# EAGLE schematic DUE_MUSICAL_ROBOTS (EAGLE 6.1)
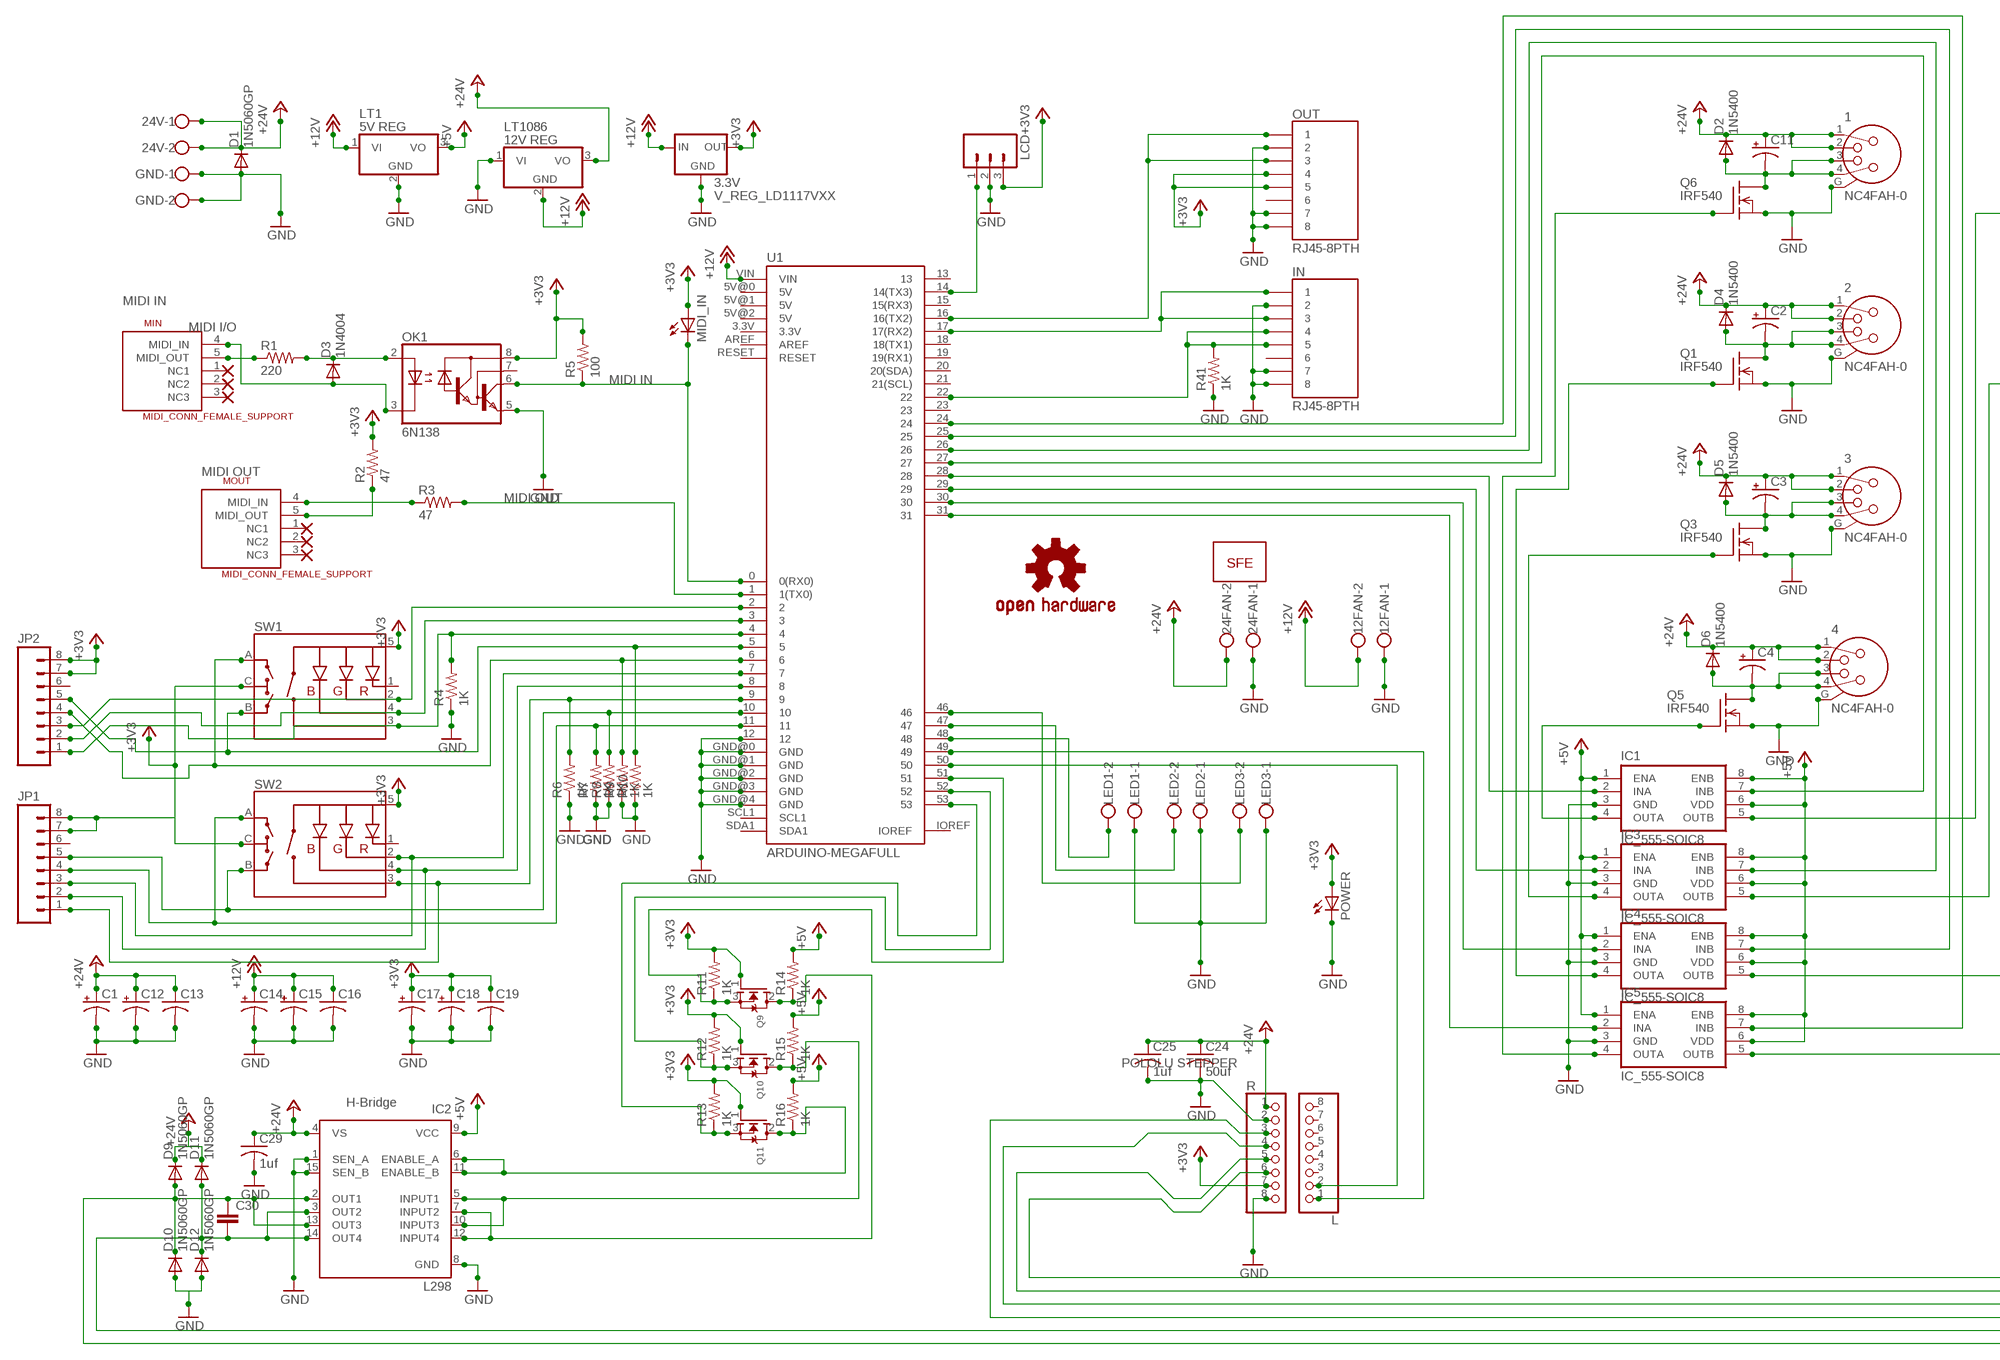
[diagram p0: schematic, sheet 1, part 1 of 2]
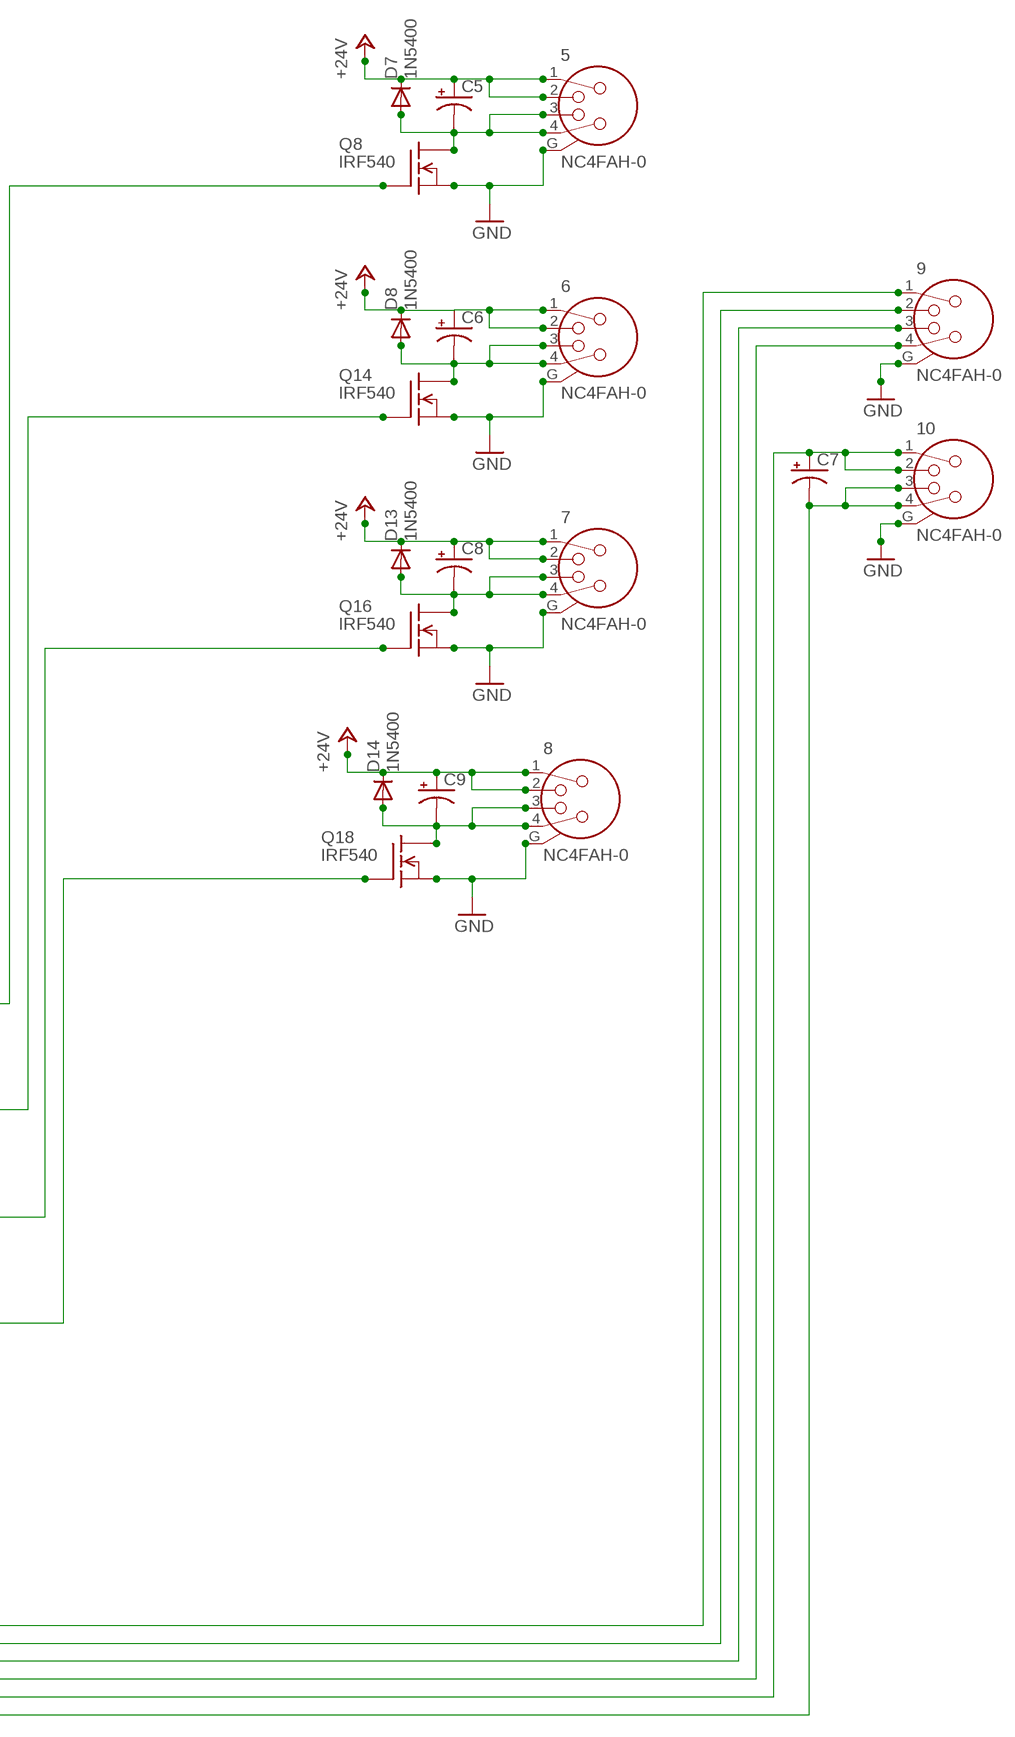
[diagram p1: schematic, sheet 1, part 2 of 2]

## Parts
1  NC4FAH-0  [NC4FAH-0]
2  NC4FAH-0  [NC4FAH-0]
3  NC4FAH-0  [NC4FAH-0]
3.3V  V_REG_LD1117VXX  [78XXL]
4  NC4FAH-0  [NC4FAH-0]
5  NC4FAH-0  [NC4FAH-0]
6  NC4FAH-0  [NC4FAH-0]
7  NC4FAH-0  [NC4FAH-0]
8  NC4FAH-0  [NC4FAH-0]
9  NC4FAH-0  [NC4FAH-0]
10  NC4FAH-0  [NC4FAH-0]
12FAN  W237-102  [W237-102]
24FAN  W237-102  [W237-102]
24V  W237-102  [W237-102]
C1  CPOL-USE2,5-6E  [E2,5-6E]
C2  CPOL-USE2.5-6  [E2,5-6]
C3  CPOL-USE2.5-6  [E2,5-6]
C4  CPOL-USE2.5-6  [E2,5-6]
C5  CPOL-USE2.5-6  [E2,5-6]
C6  CPOL-USE2.5-6  [E2,5-6]
C7  CPOL-USE2.5-6  [E2,5-6]
C8  CPOL-USE2.5-6  [E2,5-6]
C9  CPOL-USE2.5-6  [E2,5-6]
C11  CPOL-USE2.5-6  [E2,5-6]
C12  CPOL-USE2.5-5V  [E2,5-4R]
C13  C-US025-030X050  [C025-030X050]
C14  CPOL-USE2,5-6E  [E2,5-6E]
C15  CPOL-USE2.5-5V  [E2,5-4R]
C16  C-US025-030X050  [C025-030X050]
C17  CPOL-USE2,5-6E  [E2,5-6E]
C18  CPOL-USE2.5-5V  [E2,5-4R]
C19  C-US025-030X050  [C025-030X050]
C24  50uf  C-US050-075X075  [C050-075X075]
C25  1uf  C-US025-050X050  [C025-050X050]
C29  1uf  C-US025-050X050  [C025-050X050]
C30  C-EU025-024X044  [C025-024X044]
D1  1N5060GP  [DO15-12]
D2  1N5400  [DO201-15]
D3  1N4004  [DO41-10@1]
D4  1N5400  [DO201-15]
D5  1N5400  [DO201-15]
D6  1N5400  [DO201-15]
D7  1N5400  [DO201-15]
D8  1N5400  [DO201-15]
D9  1N5060GP  [DO15-12]
D10  1N5060GP  [DO15-12]
D11  1N5060GP  [DO15-12]
D12  1N5060GP  [DO15-12]
D13  1N5400  [DO201-15]
D14  1N5400  [DO201-15]
GND  W237-102  [W237-102]
IC1  IC_555-SOIC8  [SOIC-8]
IC2  L298  [MULTIWATT-15]
IC3  IC_555-SOIC8  [SOIC-8]
IC4  IC_555-SOIC8  [SOIC-8]
IC5  IC_555-SOIC8  [SOIC-8]
IN  RJ45-8PTH  [RJ45-8]
JP1  M083.5MM-8  [SCREWTERMINAL-3.5MM-8]
JP2  M083.5MM-8  [SCREWTERMINAL-3.5MM-8]
JP5  LOGO-SFEM  [SFE-LOGO]
L  PINHD-1X8  [1X08]
LCD  M03LONGPADS  [1X03_LONGPADS]
LED1  W237-102  [W237-102]
LED2  W237-102  [W237-102]
LED3  W237-102  [W237-102]
LT1  5V REG  7805TV  [TO220V]
LT1086  12V REG  7805TV  [TO220V]
MIDI_IN  LED5MM  [LED5MM]
MIN  MIDI_CONN_FEMALE_SUPPORT  [DIN_5_FEMALE_SUPPORT]
MOUT  MIDI_CONN_FEMALE_SUPPORT  [DIN_5_FEMALE_SUPPORT]
OK1  6N138  [DIL08]
OUT  RJ45-8PTH  [RJ45-8]
POWER  LED5MM  [LED5MM]
Q1  IRF540  [TO220]
Q3  IRF540  [TO220]
Q5  IRF540  [TO220]
Q6  IRF540  [TO220]
Q8  IRF540  [TO220]
Q9  MOSFET-NGDS_TO220V  [TO220V]
Q10  MOSFET-NGDS_TO220V  [TO220V]
Q11  MOSFET-NGDS_TO220V  [TO220V]
Q14  IRF540  [TO220]
Q16  IRF540  [TO220]
Q18  IRF540  [TO220]
R  PINHD-1X8  [1X08]
R1  220  R-US_0204/7  [0204/7]
R2  47  R-US_0204/7  [0204/7]
R3  47  R-US_0204/7  [0204/7]
R4  1K  RESISTORAXIAL-0.3  [AXIAL-0.3]
R5  100  R-US_0204/7  [0204/7]
R6  1K  RESISTORAXIAL-0.3  [AXIAL-0.3]
R7  1K  RESISTORAXIAL-0.3  [AXIAL-0.3]
R8  1K  RESISTORAXIAL-0.3  [AXIAL-0.3]
R9  1K  RESISTORAXIAL-0.3  [AXIAL-0.3]
R10  1K  RESISTORAXIAL-0.3  [AXIAL-0.3]
R11  1K  RESISTORAXIAL-0.3  [AXIAL-0.3]
R12  1K  RESISTORAXIAL-0.3  [AXIAL-0.3]
R13  1K  RESISTORAXIAL-0.3  [AXIAL-0.3]
R14  1K  RESISTORAXIAL-0.3  [AXIAL-0.3]
R15  1K  RESISTORAXIAL-0.3  [AXIAL-0.3]
R16  1K  RESISTORAXIAL-0.3  [AXIAL-0.3]
R41  1K  RESISTORAXIAL-0.3  [AXIAL-0.3]
SW1  ENCODER_RGB_CA  [ENCODER_LED_3]
SW2  ENCODER_RGB_CA  [ENCODER_LED_3]
U1  ARDUINO-MEGAFULL  [ARDUINO_MEGA]
U$3  OSHW-LOGOM  [OSHW-LOGO-M]

## Nets
+3V3: 3.3V.GND(OUT) C17.+ C18.+ C19.1 JP1.7 JP1.8 JP2.7 JP2.8 LCD.3 MIDI_IN.A OK1.8(VCC) OUT.4 OUT.5 POWER.A Q9.1(G) Q10.1(G) Q11.1(G) R2.2 R5.2 R11.P$2 R12.P$2 R13.P$2 R.7 SW1.5(+) SW1.C SW2.5(+) SW2.C
+5V: IC1.1(ENA) IC1.6(VDD) IC1.8(ENB) IC2.9(VCC) IC3.1(ENA) IC3.6(VDD) IC3.8(ENB) IC4.1(ENA) IC4.6(VDD) IC4.8(ENB) IC5.1(ENA) IC5.6(VDD) IC5.8(ENB) LT1.3(VO) R14.P$2 R15.P$2 R16.P$2
+12V: 3.3V.OUT(IN) 12FAN.2 C14.+ C15.+ C16.1 LT1.1(VI) LT1086.2(GND) U1.VIN
+24V: 1.1 1.2 2.1 2.2 3.1 3.2 4.1 4.2 5.1 5.2 6.1 6.2 7.1 7.2 8.1 8.2 24FAN.2 24V.1 24V.2 C1.+ C2.+ C3.+ C4.+ C5.+ C6.+ C8.+ C9.+ C11.+ C12.+ C13.1 C24.1 C25.1 C29.1 D1.C D2.C D4.C D5.C D6.C D7.C D8.C D9.C D11.C D13.C D14.C IC2.4(VS) LT1086.3(VO) R.1
DIGITALBUS8: Q10.3(S) R12.P$1 U1.52
DIGITALBUS9: Q11.3(S) R13.P$1 U1.53
DIGITALBUS11: Q9.3(S) R11.P$1 U1.51
GND: 1.G 2.G 3.3V.IN(GND) 3.G 4.G 5.G 6.G 7.G 8.G 9.G 10.G 12FAN.1 24FAN.1 C1.- C12.- C13.2 C14.- C15.- C16.2 C17.- C18.- C19.2 C24.2 C25.2 C29.2 D1.A D10.A D12.A GND.1 GND.2 IC1.3(GND) IC2.1(SEN_A) IC2.8(GND) IC2.15(SEN_B) IC3.3(GND) IC4.3(GND) IC5.3(GND) IN.2 IN.7 IN.8 LCD.2 LED1.1 LED2.1 LED3.1 LT1.2(GND) LT1086.1(VI) OK1.5(GND) OUT.2 OUT.7 OUT.8 POWER.K(C) Q1.3(S) Q3.3(S) Q5.3(S) Q6.3(S) Q8.3(S) Q14.3(S) Q16.3(S) Q18.3(S) R4.P$1 R6.P$1 R7.P$1 R8.P$1 R9.P$1 R10.P$1 R41.P$1 R.2 R.8 U1.12 U1.GND@0(GND) U1.GND@1(GND) U1.GND@2(GND) U1.GND@3(GND) U1.GND@4(GND)
MIDIIN: MIDI_IN.K(C) OK1.6(VO) R5.1 U1.0(0(RX0))
MIDIOUT: R3.2 U1.1(1(TX0))
N$1: MIN.5(MIDI_OUT) R1.1
N$2: D3.C OK1.2(A) R1.2
N$3: 2.3 2.4 C2.- D4.A Q1.2(D)
N$4: IC4.4(OUTA) Q1.1(G)
N$5: D3.A MIN.4(MIDI_IN) OK1.3(C)
N$6: MOUT.5(MIDI_OUT) R2.1
N$7: 10.1 10.2 C7.+ C30.2 D11.A D12.C IC2.3(OUT2) IC2.14(OUT4)
N$8: MOUT.4(MIDI_IN) R3.1
N$9: OUT.1 OUT.3 U1.16(16(TX2))
N$10: IN.1 IN.3 U1.17(17(RX2))
N$11: JP2.2 SW1.4(-B) U1.3
N$12: IC5.2(INA) U1.31
N$13: 3.3 3.4 C3.- D5.A Q3.2(D)
N$14: IN.4 IN.5 R41.P$2 U1.22
N$15: IC1.4(OUTA) Q5.1(G)
N$16: 1.3 1.4 C11.- D2.A Q6.2(D)
N$17: JP2.3 SW1.2(-G) U1.2
N$18: IC2.7(INPUT2) IC2.12(INPUT4) Q9.2(D) R14.P$1
N$19: JP2.1 R4.P$2 SW1.3(SW) U1.4
N$20: LCD.1 U1.14(14(TX3))
N$21: JP2.4 R9.P$2 SW1.A U1.6
N$22: 9.1 R.6
N$23: 9.3 R.4
N$24: L.2 U1.50
N$25: L.1 U1.49
N$26: 9.4 R.3
N$27: 9.2 R.5
N$28: 10.3 10.4 C7.- C30.1 D9.A D10.C IC2.2(OUT1) IC2.13(OUT3)
N$29: JP2.5 R10.P$2 SW1.B U1.5
N$30: IC2.6(ENABLE_A) IC2.11(ENABLE_B) Q11.2(D) R16.P$1
N$31: IC2.5(INPUT1) IC2.10(INPUT3)
N$32: JP1.4 R7.P$2 SW2.A U1.11
N$33: JP1.3 SW2.2(-G) U1.7
N$34: JP1.2 SW2.4(-B) U1.8
N$35: JP1.1 R6.P$2 SW2.3(SW) U1.9
N$36: JP1.5 R8.P$2 SW2.B U1.10
N$37: IC5.4(OUTA) Q6.1(G)
N$38: IC4.2(INA) U1.30
N$40: 4.3 4.4 C4.- D6.A Q5.2(D)
N$41: IC3.7(INB) U1.26
N$43: Q10.2(D) R15.P$1
N$44: 5.3 5.4 C5.- D7.A Q8.2(D)
N$47: 6.3 6.4 C6.- D8.A Q14.2(D)
N$49: IC3.4(OUTA) Q3.1(G)
N$50: 7.3 7.4 C8.- D13.A Q16.2(D)
N$53: 8.3 8.4 C9.- D14.A Q18.2(D)
N$56: IC5.7(INB) U1.24
N$57: IC4.7(INB) U1.25
N$59: LED1.2 U1.48
N$60: LED2.2 U1.47
N$61: LED3.2 U1.46
N$62: IC1.7(INB) U1.27
N$68: IC1.2(INA) U1.28
N$69: IC3.2(INA) U1.29
OUTB: IC1.5(OUTB) IC3.5(OUTB) IC4.5(OUTB) IC5.5(OUTB) Q8.1(G) Q14.1(G) Q16.1(G) Q18.1(G)
Unconnected: IN.6 JP1.6 JP2.6 L.3 L.4 L.5 L.6 L.7 L.8 MIN.1(NC1) MIN.2(NC2) MIN.3(NC3) MOUT.1(NC1) MOUT.2(NC2) MOUT.3(NC3) OK1.7(VB) OUT.6 SW1.1(-R) SW2.1(-R) U1.3.3V U1.5V@0(5V) U1.5V@1(5V) U1.5V@2(5V) U1.13 U1.15(15(RX3)) U1.18(18(TX1)) U1.19(19(RX1)) U1.20(20(SDA)) U1.21(21(SCL)) U1.23 U1.AREF U1.IOREF U1.RESET U1.SCL1 U1.SDA1

## Notes on the sheet
- MIDI IN
- MIDI I/O
- MIDI IN
- MIDI OUT
- MIDI OUT
- POLOLU STEPPER
- H-Bridge

## Library data of the parts
1-10 = con-neutrik_ag:NC4: Neutrik Audio Connector XLR SERIES Stereo 1/4" jack Source: www.neutrik.com/; MPN: NC4FAH-0; OC_FARNELL: unknown; OC_NEWARK: 45K1611
3.3V = Due:V_REG_LD1117VXX: LD1117VXX voltage regulator. We carry the 3.3V version (COM-00526) in TO-220 package.
12FAN 24FAN 24V GND LED1-LED3 = con-wago-500:W237-102: WAGO SCREW CLAMP; MPN: 237-102; OC_FARNELL: unknown; OC_NEWARK: 70K9898
C1-C9 C11 C12 C14 C15 C17 C18 = adafruit:CPOL-US: POLARIZED CAPACITOR, American symbol
C13 C16 C19 C25 C29 = adafruit:C-US: CAPACITOR, American symbol
C24 = rcl:C-US: CAPACITOR, American symbol
C30 = rcl:C-EU: CAPACITOR, European symbol
D1 D9-D12 = diode:1N5060GP: DIODE controlled avalanche rectifier
D2 D4-D8 D13 D14 = diode:1N5400: DIODE standard rectifier, 3 A, 50 V (Motorola)
D3 = adafruit:1N4004: DIODE
IC1 IC3-IC5 = dp_devices:IC_555: Classic 555 IC
IC2 = st-microelectronics:L298: DUAL FULL-BRIDGE DRIVER; MPN: L298N; OC_FARNELL: 1589425; OC_NEWARK: 32M1527
IN OUT = Due:RJ45-8: RJ45 Jack Simple RJ45, 8-pin connection - connector for common Cat5, Cat5e, and Cat6 Ethernet cables. Footprint not yet proven in production. Connector sku is PRT-00643; Breakout PCB sku is BOB-00716.
JP1 JP2 = Due:M08: Header 8 Standard 8-pin 0.1" header. Use with straight break away headers (SKU : PRT-00116), right angle break away headers (PRT-00553), swiss pins (PRT-00743), machine pins (PRT-00117), and female headers (PRT-00115).
JP5 = Due:LOGO-SFE: Spark Fun Electronics PCB Logo This is the standard Spark Fun Electronics PCB logo.
L R = pinhead:PINHD-1X8: PIN HEADER
LCD = Due:M03: Header 3 Standard 3-pin 0.1" header. Use with straight break away headers (SKU : PRT-00116), right angle break away headers (PRT-00553), swiss pins (PRT-00743), machine pins (PRT-00117), and female headers (PRT-00115). Molex polarized connector foot print use with SKU : PRT-08232 with associated crimp pins and housings.
LT1 LT1086 = linear:78*: Positive VOLTAGE REGULATOR Source: http://cache.national.com/ds/LM/LM78L05.pdf http://www.fairchildsemi.com/ds/LM/LM7805.pdf
MIDI_IN POWER = adafruit:LED: LED OSRAM: - CHIPLED LG R971, LG N971, LY N971, LG Q971, LY Q971, LO R971, LY R971 LH N974, LH R974 LS Q976, LO Q976, LY Q976 LO Q996 - Hyper CHIPLED LW Q18S LB Q993, LB Q99A, LB R99A - SideLED LS A670, LO A670, LY A670, LG A670, LP A670 LB A673, LV A673, LT A673, LW A673 LH A674 LY A675 LS A676, LA A676, LO A676, LY A676, LW A676 LS A679, LY A679, LG A679 - Hyper Micro SIDELED® LS Y876, LA Y876, LO Y876, LY Y876 LT Y87S - SmartLED LW L88C, LW L88S LB L89C, LB L89S, LG L890 LS L89K, LO L89K, LY L89K LS L896, LA L896, LO L896, LY L896 - TOPLED LS T670, LO T670, LY T670, LG T670, LP T670 LSG T670, LSP T670, LSY T670, LOP T670, LYG T670 LG T671, LOG T671, LSG T671 LB T673, LV T673, LT T673, LW T673 LH T674 LS T676, LA T676, LO T676, LY T676, LB T676, LH T676, LSB T676, LW T676 LB T67C, LV T67C, LT T67C, LS T67K, LO T67K, LY T67K, LW E67C LS E67B, LA E67B, LO E67B, LY E67B, LB E67C, LV E67C, LT E67C LW T67C LS T679, LY T679, LG T679 LS T770, LO T770, LY T770, LG T770, LP T770 LB T773, LV T773, LT T773, LW T773 LH T774 LS E675, LA E675, LY E675, LS T675 LS T776, LA T776, LO T776, LY T776, LB T776 LHGB T686 LT T68C, LB T68C - Hyper Mini TOPLED® LB M676 - Mini TOPLED Santana® LG M470 LS M47K, LO M47K, LY M47K Source: http://www.osram.convergy.de/
MIN MOUT = SparkFun-Connectors:MIDI_CONN_FEMALE_SUPPORT: MIDI connector with strain relief (DIN-5 female)
OK1 = optocoupler:6N138: MOTOROLA OPTO COUPLER; MF: VISHAY/TELEFUNKEN; MPN: 6N138; OC_FARNELL: 9860150; OC_NEWARK: 35K5294
Q1 Q3 Q5 Q6 Q8 Q14 Q16 Q18 = transistor-fet:IRF540: N-Channel Enhancement MOSFET (HEXFET); 100V; 28A; 0,077Ohm
Q9-Q11 = adafruit:MOSFET-N: N-Channel Mosfet 2N7002E - 60V 260mA SOT23 [Digikey: 2N7002ET1GOSTR-ND] - REEL BSH103 - 30V 850mA SOT23 [Digikey: 568-5013-1-ND]
R1-R3 R5 = adafruit:R-US_: RESISTOR, American symbol
R4 R6-R16 R41 = SparkFun:RESISTOR: Resistor Basic schematic elements and footprints for 0603, 1206, and PTH resistors.
SW1 SW2 = SparkFun:ENCODER_RGB_CA: Illuminated Rotary Encoder w/ RGB LED and select switch EC12PLRGBSDVBF-D: http://top-up.so-buy.com/front/bin/ptdetail.phtml?Part=EC12PLRGBSDVBF-D
U1 = Due:ARDUINO-MEGA: Arduino Mega footprint connections
U$3 = Due:OSHW-LOGO: Open Source Hardware Logo This logo indicates the piece of hardware it is found on incorporates a OSHW license and/or adheres to the definition of open source hardware found here: http://freedomdefined.org/OSHW

## Net classes
0 Signal: width 0.508 mm
1 Power: width 1.016 mm